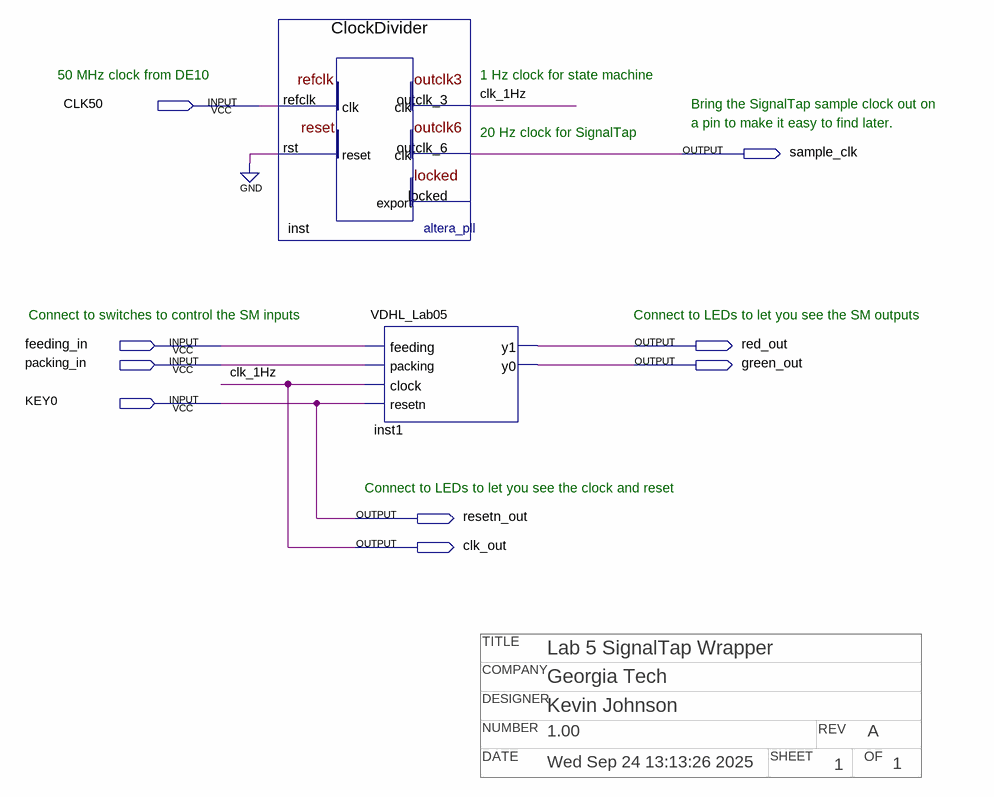
[diagram p0: schematic sheet]
// Quartus schematic Lab5Wrapper.bdf as structural Verilog: 2 symbols, 9 pins
// Title block: COMPANY: Georgia Tech; DATE: Wed Sep 24 13:13:26 2025; DESIGNER: Kevin Johnson; NUMBER: 1.00; OF: 1; REV: A; SHEET: 1; TITLE: Lab 5 SignalTap Wrapper
module Lab5Wrapper (
  input  CLK50,
  input  feeding_in,
  input  packing_in,
  input  KEY0,
  output sample_clk,
  output red_out,
  output green_out,
  output resetn_out,
  output clk_out
);

  ClockDivider inst (.refclk(CLK50), .rst(1'b0), .outclk_3(clk_out), .outclk_6(sample_clk));  // open: locked
  VDHL_Lab05 inst1 (
    .feeding(feeding_in), .packing(packing_in), .clock(clk_out), .resetn(KEY0), .y1(red_out), .y0(green_out));

  assign resetn_out = KEY0;

  // Other names for the same wires on the sheet: clk_1Hz = clk_out

  // Notes on the sheet:
  //   50 MHz clock from DE10
  //   1 Hz clock for state machine
  //   Bring the SignalTap sample clock out on
  //   a pin to make it easy to find later.
  //   20 Hz clock for SignalTap
  //   Connect to switches to control the SM inputs
  //   Connect to LEDs to let you see the SM outputs
  //   Connect to LEDs to let you see the clock and reset
endmodule
